# EasyEDA schematic SCH_diyson_2024-04-04.json
TITLE: Sheet_1; REV: 1.0; Date: 2024-03-12; Sheet: 1/1; Drawn By: jurgen2107; Company: Your Company
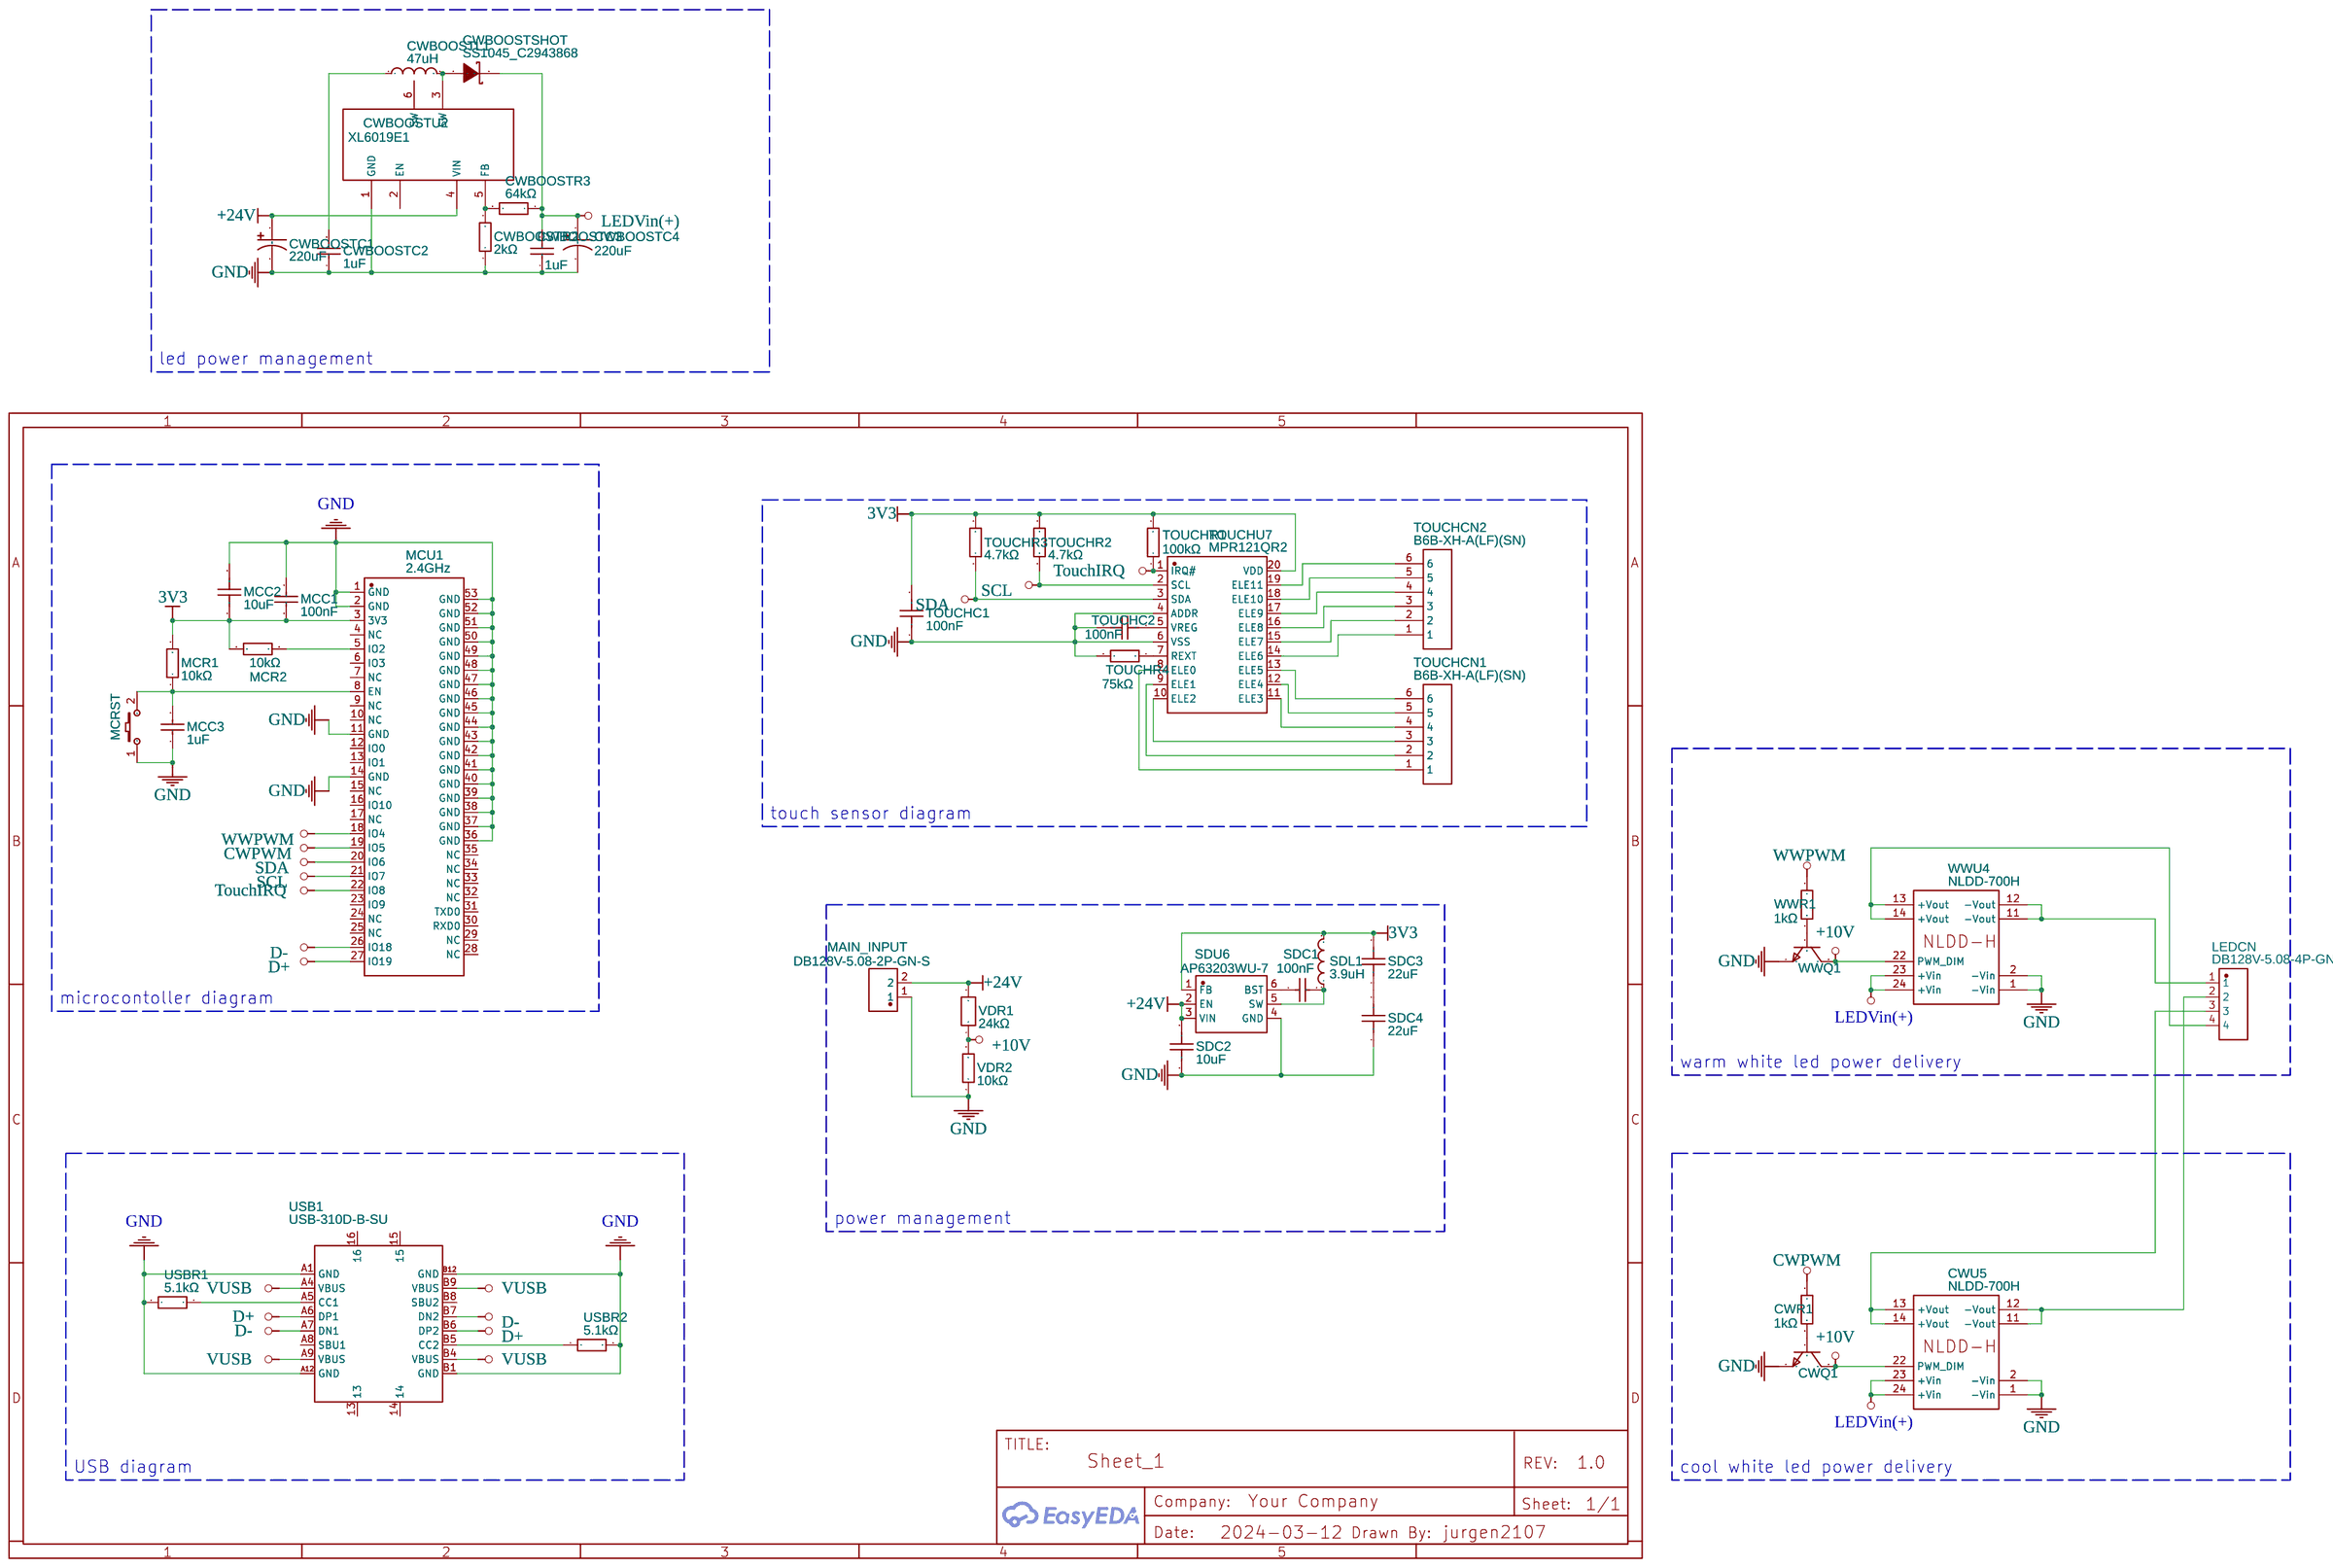
[diagram p0: schematic sheet]

## Parts
CWBOOSTC1  220uF  [CAP-SMD_BD8.0-L8.3-W8.3-FD]
CWBOOSTC2  1uF  [C0603]
CWBOOSTC3  1uF  [C0603]
CWBOOSTC4  220uF  [CAP-SMD_BD10.0-L10.3-W10.3-LS11.3-FD]
CWBOOSTL1  47uH  [IND-SMD_L10.0-W10.0_MDA1040-220M]
CWBOOSTR2  2kΩ  [R0603]
CWBOOSTR3  64kΩ  [R0603]
CWBOOSTSHOT  SS1045_C2943868  [SMC_L6.9-W5.9-LS7.9-RD]
CWBOOSTU2  XL6019E1  [TO-263-5_L10.2-W9.9-P1.70-LS14.4-TL]
CWQ1  2N3904_C2874602  [TO-92-3_L4.6-W3.6-P1.30-L_2N3904]
CWR1  1kΩ  [R0603]
CWU5  NLDD-700H  [NLDD-H]
LEDCN  DB128V-5.08-4P-GN-S  [CONN-TH_4P-P5.08_DIBO_DB128V-5.08]
MAIN_INPUT  DB128V-5.08-2P-GN-S  [CONN-TH_2P-P5.08_DIBO_DB128V-5.08]
MCC1  100nF  [C0603]
MCC2  10uF  [C0603]
MCC3  1uF  [C0603]
MCR1  10kΩ  [R0603]
MCR2  10kΩ  [R0603]
MCRST  K2-3.6×6.1_SMD  [KEY-SMD_2P-L6.2-W3.6-LS8.0]
MCU1  2.4GHz  [WIFIM-SMD_ESP32-C3-MINI-1]
SDC1  100nF  [C0603]
SDC2  10uF  [C0603]
SDC3  22uF  [C0603]
SDC4  22uF  [C0603]
SDL1  3.9uH  [L1812]
SDU6  AP63203WU-7  [TSOT-26_L2.9-W1.6-P0.95-LS2.8-BL]
TOUCHC1  100nF  [C0603]
TOUCHC2  100nF  [C0603]
TOUCHCN1  B6B-XH-A(LF)(SN)  [CONN-TH_6P-P2.50_B6B-XH-A-LF-SN]
TOUCHCN2  B6B-XH-A(LF)(SN)  [CONN-TH_6P-P2.50_B6B-XH-A-LF-SN]
TOUCHR1  100kΩ  [R0603]
TOUCHR2  4.7kΩ  [R0603]
TOUCHR3  4.7kΩ  [R0603]
TOUCHR4  75kΩ  [R0603]
TOUCHU7  MPR121QR2  [QFN-20_L3.0-W3.0-P0.40-BL]
USB1  USB-310D-B-SU  [USB-C-SMD_USB-310D-B-SU]
USBR1  5.1kΩ  [R0603]
USBR2  5.1kΩ  [R0603]
VDR1  24kΩ  [R0603]
VDR2  10kΩ  [R0603]
WWQ1  2N3904_C2874602  [TO-92-3_L4.6-W3.6-P1.30-L_2N3904]
WWR1  1kΩ  [R0603]
WWU4  NLDD-700H  [NLDD-H]

## Library data of the parts
CWBOOSTC1 = UUD1V221MNL1GS: Contributor: LCSC; Supplier: LCSC; Supplier Part: C251000; Manufacturer: Nichicon(尼吉康); JLCPCB Part Class: Extended Part
CWBOOSTC2 CWBOOSTC3 = CL10A105KB8NNNC: Supplier: LCSC; Manufacturer: SAMSUNG(三星); Supplier Part: C15849; JLCPCB Part Class: Basic Part
CWBOOSTC4 = UWT1H221MNL1GS: Contributor: LCSC; Supplier: LCSC; Supplier Part: C125977; Manufacturer: Nichicon(尼吉康); JLCPCB Part Class: Extended Part
CWBOOSTL1 = MDA1040-470M: Contributor: lcsc; Supplier: LCSC; Supplier Part: C2847557; Manufacturer: KOHERelec(科或); JLCPCB Part Class: Extended Part
CWBOOSTR2 = 0603WAF2001T5E: Supplier: LCSC; Manufacturer: UNI-ROYAL(厚声); Supplier Part: C22975; JLCPCB Part Class: Basic Part
CWBOOSTR3 = AR03DTC6402N: Contributor: LCSC; Supplier: LCSC; Supplier Part: C374581; Manufacturer: Viking(光颉); JLCPCB Part Class: Extended Part
CWBOOSTSHOT = SS1045_C2943868: Contributor: lcsc; Supplier: LCSC; Supplier Part: C2943868; Manufacturer: GOODWORK(固得沃克); Manufacturer Part: SS1045
CWBOOSTU2 = XL6019E1: Supplier: LCSC; Manufacturer: XLSEMI(芯龙); Supplier Part: C73018; JLCPCB Part Class: Extended Part
CWQ1 WWQ1 = 2N3904_C2874602: Contributor: LCSC; Supplier: LCSC; Supplier Part: C2874602; Manufacturer: JSMSEMI(杰盛微); Manufacturer Part: 2N3904; JLCPCB Part Class: Extended Part
CWR1 WWR1 = 0603WAF1001T5E: Supplier: LCSC; Manufacturer: UNI-ROYAL(厚声); Supplier Part: C21190; JLCPCB Part Class: Basic Part
CWU5 WWU4 = NLDD-700H: Manufacturer: MEAN WELL; Manufacturer Part: 709-NLDD-700H; Supplier: Mouser; link: https://www.mouser.de/ProductDetail/709-NLDD-700H; Contributor: robster089
LEDCN = DB128V-5.08-4P-GN-S: Contributor: LCSC; Supplier: LCSC; Supplier Part: C2915641; Manufacturer: DORABO(地博电气); JLCPCB Part Class: Extended Part
MAIN_INPUT = DB128V-5.08-2P-GN-S: Contributor: LCSC; Supplier: LCSC; Supplier Part: C2915639; Manufacturer: DIBO(地博电气); JLCPCB Part Class: Extended Part
MCC1 = CL10B104KO8NNNC: Supplier: LCSC; Manufacturer: SAMSUNG(三星); Supplier Part: C66501; JLCPCB Part Class: Extended Part
MCC2 = CL10X106MR8NNNC: Contributor: LCSC; Supplier: LCSC; Supplier Part: C318635; Manufacturer: SAMSUNG(三星); JLCPCB Part Class: Extended Part
MCC3 = CL10A105KP8NNNC: Supplier: LCSC; Manufacturer: SAMSUNG(三星); Supplier Part: C26413; JLCPCB Part Class: Extended Part
MCR1 MCR2 = 0603WAF1002T5E: Supplier: LCSC; Manufacturer: UNI-ROYAL(厚声); Supplier Part: C25804; JLCPCB Part Class: Basic Part
MCRST = K2-3.6×6.1_SMD: Supplier Part: C118141; Supplier: LCSC; Manufacturer Part: K2-1107ST-A4SW-06; Contributor: LCEDA_Lib; 制造商: 韩国韩荣
MCU1 = ESP32-C3-MINI-1-H4(4MB): Contributor: LCSC; Supplier: LCSC; Supplier Part: C2934569; Manufacturer: ESPRESSIF(乐鑫); Manufacturer Part: ESP32-C3-MINI-1-H4; JLCPCB Part Class: Extended Part
SDC1 = CL10B104KA8NNNC: Supplier: LCSC; Manufacturer: SAMSUNG(三星); Supplier Part: C1590; JLCPCB Part Class: Extended Part
SDC2 = CL10A106MA8NRNC: Supplier: LCSC; Manufacturer: SAMSUNG(三星); Supplier Part: C96446; JLCPCB Part Class: Basic Part
SDC3 SDC4 = CL10A226MP8NUNE: Supplier: LCSC; Manufacturer: SAMSUNG(三星); Supplier Part: C86295; JLCPCB Part Class: Extended Part
SDL1 = FHW1812IF3R9JST: Contributor: LCSC; Supplier: LCSC; Supplier Part: C394117; Manufacturer: FH(风华); JLCPCB Part Class: Extended Part
SDU6 = AP63203WU-7: Contributor: LCSC; Supplier: LCSC; Supplier Part: C780769; Manufacturer: DIODES(美台); JLCPCB Part Class: Extended Part
TOUCHC1 TOUCHC2 = CL10B104KB8NNNC: Supplier: LCSC; Manufacturer: SAMSUNG(三星); Supplier Part: C1591; JLCPCB Part Class: Extended Part
TOUCHCN1 TOUCHCN2 = B6B-XH-A(LF)(SN): Contributor: LCSC; Supplier: LCSC; Supplier Part: C144397; Manufacturer: JST; JLCPCB Part Class: Extended Part
TOUCHR1 = 0603WAF1003T5E: Supplier: LCSC; Manufacturer: UNI-ROYAL(厚声); Supplier Part: C25803; JLCPCB Part Class: Basic Part
TOUCHR2 TOUCHR3 = 0603WAF4701T5E: Supplier: LCSC; Manufacturer: UNI-ROYAL(厚声); Supplier Part: C23162; JLCPCB Part Class: Basic Part
TOUCHR4 = 0603WAF7502T5E: Supplier: LCSC; Manufacturer: UNI-ROYAL(厚声); Supplier Part: C23242; JLCPCB Part Class: Basic Part
TOUCHU7 = MPR121QR2: Contributor: LCSC; Supplier: LCSC; Supplier Part: C91322; Manufacturer: NXP(恩智浦); JLCPCB Part Class: Extended Part
USB1 = USB-310D-B-SU: Contributor: LCSC; Supplier: LCSC; Supplier Part: C309349; Manufacturer: HOOYA(皓宇电子); JLCPCB Part Class: Extended Part
USBR1 USBR2 = 0603WAF5101T5E: Supplier: LCSC; Manufacturer: UNI-ROYAL(厚声); Supplier Part: C23186; JLCPCB Part Class: Basic Part
VDR1 = ERJPB3B2402V: Contributor: LCSC; Supplier: LCSC; Supplier Part: C413706; Manufacturer: PANASONIC(松下); JLCPCB Part Class: Extended Part
VDR2 = ERJPB3B1002V: Contributor: LCSC; Supplier: LCSC; Supplier Part: C161787; Manufacturer: PANASONIC(松下); JLCPCB Part Class: Extended Part

## Nets
3V3: MCC1.1 MCC2.1 MCR1.2 MCR2.2 MCU1.3(3V3) SDC3.2 SDL1.2 SDU6.1(FB) TOUCHC1.2 TOUCHR1.2 TOUCHR2.2 TOUCHR3.2 TOUCHU7.20(VDD)
+10V: CWQ1.3(C) CWU5.22(PWM DIM) VDR1.1 VDR2.2 WWQ1.3(C) WWU4.22(PWM DIM)
+24V: CWBOOSTC1.1 CWBOOSTU2.4(VIN) MAIN_INPUT.2 SDC2.2 SDU6.2(EN) SDU6.3(VIN) VDR1.2
GND: CWBOOSTC1.2 CWBOOSTC2.1 CWBOOSTC3.1 CWBOOSTC4.2 CWBOOSTR2.1 CWBOOSTU2.1(GND) CWQ1.1(E) CWU5.1(-Vin) CWU5.2(-Vin) MAIN_INPUT.1 MCC1.2 MCC2.2 MCC3.1 MCRST.1 MCU1.1(GND) MCU1.2(GND) MCU1.11(GND) MCU1.14(GND) MCU1.36(GND) MCU1.37(GND) MCU1.38(GND) MCU1.39(GND) MCU1.40(GND) MCU1.41(GND) MCU1.42(GND) MCU1.43(GND) MCU1.44(GND) MCU1.45(GND) MCU1.46(GND) MCU1.47(GND) MCU1.48(GND) MCU1.49(GND) MCU1.50(GND) MCU1.51(GND) MCU1.52(GND) MCU1.53(GND) SDC2.1 SDC4.1 SDU6.4(GND) TOUCHC1.1 TOUCHC2.1 TOUCHR4.2 TOUCHU7.4(ADDR) TOUCHU7.6(VSS) USB1.A1(GND) USB1.A12(GND) USB1.B1(GND) USB1.B12(GND) USBR1.1 USBR2.2 VDR2.1 WWQ1.1(E) WWU4.1(-Vin) WWU4.2(-Vin)
CWPWM: CWR1.1 MCU1.19(IO5)
D+: MCU1.27(IO19) USB1.A6(DP1) USB1.B6(DP2)
D-: MCU1.26(IO18) USB1.A7(DN1) USB1.B7(DN2)
LEDVin(+): CWBOOSTC3.2 CWBOOSTC4.1 CWBOOSTR3.1 CWBOOSTSHOT.1(C) CWU5.23(+Vin) CWU5.24(+Vin) WWU4.23(+Vin) WWU4.24(+Vin)
SCL: MCU1.21(IO7) TOUCHR2.1 TOUCHU7.2(SCL)
SDA: MCU1.20(IO6) TOUCHR3.1 TOUCHU7.3(SDA)
TouchIRQ: MCU1.22(IO8) TOUCHR1.1 TOUCHU7.1(IRQ#)
VUSB: USB1.A4(VBUS) USB1.A9(VBUS) USB1.B4(VBUS) USB1.B9(VBUS)
WWPWM: MCU1.18(IO4) WWR1.1
Net-(CWBOOSTC2-2): CWBOOSTC2.2 CWBOOSTL1.1
Net-(CWBOOSTL1-2): CWBOOSTL1.2 CWBOOSTSHOT.2(A) CWBOOSTU2.3(SW)
Net-(CWBOOSTR2-2): CWBOOSTR2.2 CWBOOSTR3.2 CWBOOSTU2.5(FB)
Net-(CWQ1-2): CWQ1.2(B) CWR1.2
Net-(CWU5-11): CWU5.11(-Vout) CWU5.12(-Vout) LEDCN.2
Net-(CWU5-13): CWU5.13(+Vout) CWU5.14(+Vout) LEDCN.3
Net-(LEDCN-1): LEDCN.1 WWU4.11(-Vout) WWU4.12(-Vout)
Net-(LEDCN-4): LEDCN.4 WWU4.13(+Vout) WWU4.14(+Vout)
Net-(MCC3-2): MCC3.2 MCR1.1 MCRST.2 MCU1.8(EN)
Net-(MCR2-1): MCR2.1 MCU1.5(IO2)
Net-(SDC1-1): SDC1.1 SDU6.6(BST)
Net-(SDC1-2): SDC1.2 SDL1.1 SDU6.5(SW)
Net-(SDC3-1): SDC3.1 SDC4.2
Net-(TOUCHC2-2): TOUCHC2.2 TOUCHU7.5(VREG)
Net-(TOUCHCN1-1): TOUCHCN1.1 TOUCHU7.8(ELE0)
Net-(TOUCHCN1-2): TOUCHCN1.2 TOUCHU7.9(ELE1)
Net-(TOUCHCN1-3): TOUCHCN1.3 TOUCHU7.10(ELE2)
Net-(TOUCHCN1-4): TOUCHCN1.4 TOUCHU7.11(ELE3)
Net-(TOUCHCN1-5): TOUCHCN1.5 TOUCHU7.12(ELE4)
Net-(TOUCHCN1-6): TOUCHCN1.6 TOUCHU7.13(ELE5)
Net-(TOUCHCN2-1): TOUCHCN2.1 TOUCHU7.14(ELE6)
Net-(TOUCHCN2-2): TOUCHCN2.2 TOUCHU7.15(ELE7)
Net-(TOUCHCN2-3): TOUCHCN2.3 TOUCHU7.16(ELE8)
Net-(TOUCHCN2-4): TOUCHCN2.4 TOUCHU7.17(ELE9)
Net-(TOUCHCN2-5): TOUCHCN2.5 TOUCHU7.18(ELE10)
Net-(TOUCHCN2-6): TOUCHCN2.6 TOUCHU7.19(ELE11)
Net-(TOUCHR4-1): TOUCHR4.1 TOUCHU7.7(REXT)
Net-(USB1-A5): USB1.A5(CC1) USBR1.2
Net-(USB1-B5): USB1.B5(CC2) USBR2.1
Net-(WWQ1-2): WWQ1.2(B) WWR1.2

Not connected (* = marked no-connect by the designer): CWBOOSTU2 2(EN) 6(SW); MCU1 4(NC) 6(IO3) 7(NC) 9(NC) 10(NC) 12(IO0) 13(IO1) 15(NC) 16(IO10) 17(NC) 23(IO9) 24(NC) 25(NC) 28(NC) 29(NC) 30(RXD0) 31(TXD0) 32(NC) 33(NC) 34(NC) 35(NC); USB1 13 14 15 16 A8(SBU1) B8(SBU2)

## Notes on the sheet
- led power management
- touch sensor diagram
- microcontoller diagram
- warm white led power delivery
- power management
- USB diagram
- cool white led power delivery
